# Altium schematic sheet Power.SchDoc
size A4
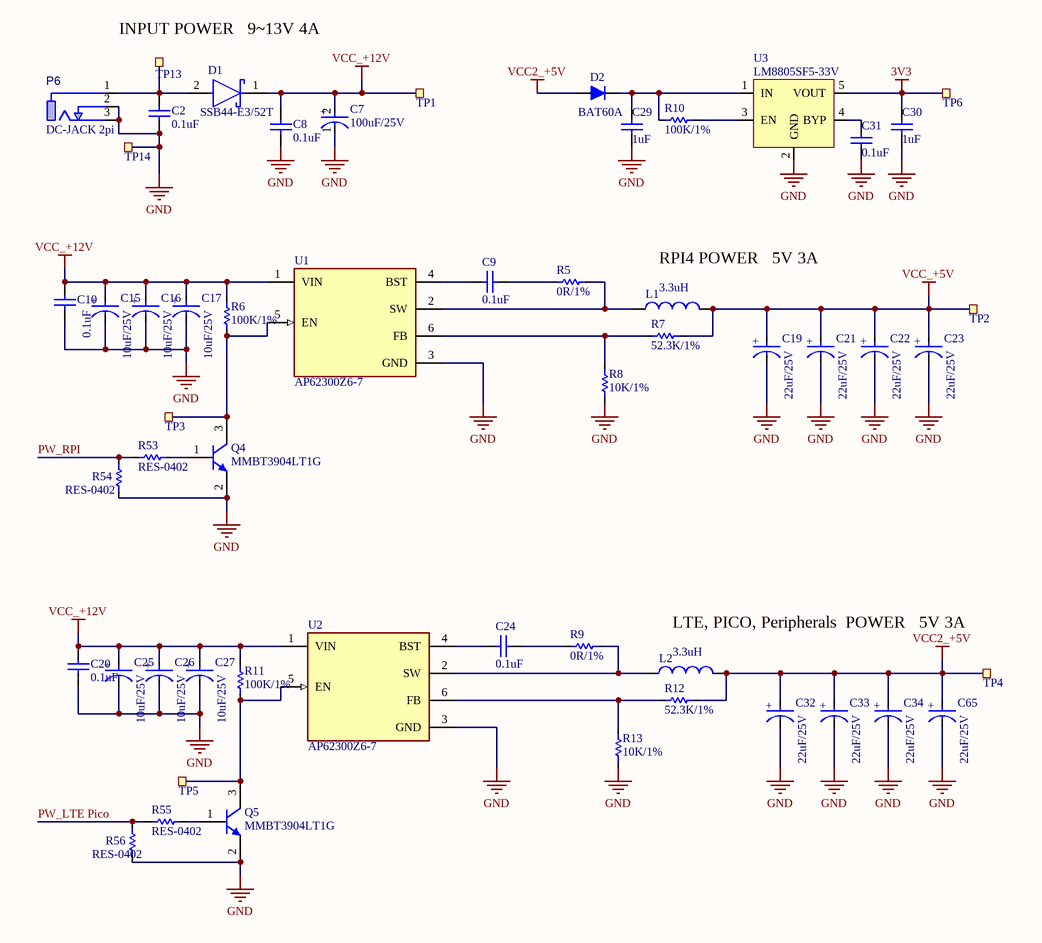
[diagram p0: Power.SchDoc]

## Parts
C2  0.1uF  [CAP-0402]
C7  100uF/25V  [CAP-6.3EC(2+)]
C8  0.1uF  [CAP-0402]
C9  0.1uF  [CAP-0402]
C10  0.1uF  [CAP-0402]
C15  10uF/25V  [CAP-A Size-(2+)]
C16  10uF/25V  [CAP-A Size-(2+)]
C17  10uF/25V  [CAP-A Size-(2+)]
C19  22uF/25V  [CAP-A Size-(2+)]
C20  0.1uF  [CAP-0402]
C21  22uF/25V  [CAP-A Size-(2+)]
C22  22uF/25V  [CAP-A Size-(2+)]
C23  22uF/25V  [CAP-A Size-(2+)]
C24  0.1uF  [CAP-0402]
C25  10uF/25V  [CAP-A Size-(2+)]
C26  10uF/25V  [CAP-A Size-(2+)]
C27  10uF/25V  [CAP-A Size-(2+)]
C29  1uF  [CAP-0402]
C30  1uF  [CAP-0402]
C31  0.1uF  [CAP-0402]
C32  22uF/25V  [CAP-A Size-(2+)]
C33  22uF/25V  [CAP-A Size-(2+)]
C34  22uF/25V  [CAP-A Size-(2+)]
C65  22uF/25V  [CAP-A Size-(2+)]
D1  SSB44-E3/52T  [DO-214AA/SMB(1-C,2-A)]
D2  BAT60A  [SOD-323(1-C,2-A)]
L1  3.3uH  [LPF7030]
L2  3.3uH  [LPF7030]
P6  DC-JACK 2pi  [DC-JACK 2pi]
Q4  MMBT3904LT1G  [ONSC-SOT-23-3-318-08_V]
Q5  MMBT3904LT1G  [ONSC-SOT-23-3-318-08_V]
R5  0R/1%  [RES-0402]
R6  100K/1%  [RES-0402]
R7  52.3K/1%  [RES-0402]
R8  10K/1%  [RES-0402]
R9  0R/1%  [RES-0402]
R10  100K/1%  [RES-0402]
R11  100K/1%  [RES-0402]
R12  52.3K/1%  [RES-0402]
R13  10K/1%  [RES-0402]
R53  RES-0402  [RES-0402]
R54  RES-0402  [RES-0402]
R55  RES-0402  [RES-0402]
R56  RES-0402  [RES-0402]
TP1  TESTPOINT  [TP(SMD)-1PI]  (value not drawn)
TP2  TESTPOINT  [TP(SMD)-1PI]  (value not drawn)
TP3  TESTPOINT  [TP(SMD)-1PI]  (value not drawn)
TP4  TESTPOINT  [TP(SMD)-1PI]  (value not drawn)
TP5  TESTPOINT  [TP(SMD)-1PI]  (value not drawn)
TP6  TESTPOINT  [TP(SMD)-1PI]  (value not drawn)
TP13  TESTPOINT  [TP(SMD)-1PI]  (value not drawn)
TP14  TESTPOINT  [TP(SMD)-1PI]  (value not drawn)
U1  AP62300Z6-7  [SOT-563]
U2  AP62300Z6-7  [SOT-563]
U3  LM8805SF5-33V  [SOT-23-5L]

## Nets
3V3: C30.2 TP6.1(TETSPOINT) U3.5(VOUT)
GND: C2.2 C7.1(C) C8.2 C10.2 C15.1(C) C16.1(C) C17.1(C) C19.1(C) C20.2 C21.1(C) C22.1(C) C23.1(C) C25.1(C) C26.1(C) C27.1(C) C29.1 C30.1 C31.1 C32.1(C) C33.1(C) C34.1(C) C65.1(C) P6.2(GND) P6.3(GND) Q4.2(E) Q5.2(E) R8.2 R13.2 R54.1 R56.1 TP14.1(TETSPOINT) U1.3(GND) U2.3(GND) U3.2(GND)
VCC2_+5V: C32.2(A) C33.2(A) C34.2(A) C65.2(A) D2.2(A) L2.2 R12.1 TP4.1(TETSPOINT)
VCC_+5V: C19.2(A) C21.2(A) C22.2(A) C23.2(A) L1.2 R7.1 TP2.1(TETSPOINT)
VCC_+12V: C7.2(A) C8.1 C10.1 C15.2(A) C16.2(A) C17.2(A) C20.1 C25.2(A) C26.2(A) C27.2(A) D1.1(C) R6.2 R11.2 TP1.1(TETSPOINT) U1.1(VIN) U2.1(VIN)
PW_LTE Pico: R55.2 R56.2
PW_RPI: R53.2 R54.2
NetC2_1: C2.1 D1.2(A) P6.1(VCC) TP13.1(TETSPOINT)
NetC9_1: C9.1 U1.4(BST)
NetC9_2: C9.2 R5.2
NetC24_1: C24.1 U2.4(BST)
NetC24_2: C24.2 R9.2
NetC29_2: C29.2 D2.1(K) R10.1 U3.1(IN)
NetC31_2: C31.2 U3.4(BYP)
NetL1_1: L1.1 R5.1 U1.2(SW)
NetL2_1: L2.1 R9.1 U2.2(SW)
NetQ4_1: Q4.1(B) R53.1
NetQ4_3: Q4.3(C) R6.1 TP3.1(TETSPOINT) U1.5(EN)
NetQ5_1: Q5.1(B) R55.1
NetQ5_3: Q5.3(C) R11.1 TP5.1(TETSPOINT) U2.5(EN)
NetR7_2: R7.2 R8.1 U1.6(FB)
NetR10_2: R10.2 U3.3(EN)
NetR12_2: R12.2 R13.1 U2.6(FB)

## Notes on the sheet
- (near TP13) INPUT POWER   9~13V 4A
- (near L1) RPI4 POWER   5V 3A
- LTE, PICO, Peripherals  POWER   5V 3A
- (in symbol CMP-03017-000014-1) +

## Library data of the parts
C2 C8-C10 C20 C24 C29-C31 = CAP-0402: Ceramic CAP 0402(1005)
C7 = CMP-03017-000014-1: CHIP ALUMINUM ELECTROLYTIC CAPACITORS, 6.3파이; Tolerance: 20%; Life (Hours): 2000Hour; Voltage Rating: 6.3V; ESR (Equivalent Series Resistance): 45mR; Capacitance: 100uF; Case Code (Metric): 3216; Features: General Purpose; Max Operating Temperature: 105°C; Case/Package: 1206; Case Code (Imperial): 1206; Min Operating Temperature: -55°C; Mount: Surface Mount; Packaging: Tape and Reel; RoHS Compliant: Yes
C15-C17 C25-C27 = CMP-03017-000014-1: Chip Tantal A size 10uF 16V; Tolerance: 20%; Life (Hours): 2000Hour; Voltage Rating: 6.3V; ESR (Equivalent Series Resistance): 45mR; Capacitance: 100uF; Case Code (Metric): 3216; Features: General Purpose; Max Operating Temperature: 105°C; Case/Package: 1206; Case Code (Imperial): 1206; Min Operating Temperature: -55°C; Mount: Surface Mount; Packaging: Tape and Reel; RoHS Compliant: Yes
C19 C21-C23 C32-C34 C65 = CMP-03017-000014-1: Chip Tantal A size 22uF 25V; Tolerance: 20%; Life (Hours): 2000Hour; Voltage Rating: 6.3V; ESR (Equivalent Series Resistance): 45mR; Capacitance: 100uF; Case Code (Metric): 3216; Features: General Purpose; Max Operating Temperature: 105°C; Case/Package: 1206; Case Code (Imperial): 1206; Min Operating Temperature: -55°C; Mount: Surface Mount; Packaging: Tape and Reel; RoHS Compliant: Yes
D1 = CMP-1055-00376-2: SMB (DO-214AA); Max Reverse Leakage Current: 2mA; Polarity: Standard; Average Rectified Current: 4A; Max Surge Current: 80A; Output Current: 3A; Element Configuration: Single; Voltage Rating (DC): 20V; Forward Voltage: 500mV; Packaging: Tape and Reel; Package Quantity: 1; Length: 7.11mm; Lead Free: Lead Free; Peak Non-Repetitive Surge Current: 80A; Width: 6.1mm; Max Forward Surge Current (Ifsm): 80A; Height: 2.26mm; Peak Reverse Current: 2mA; Max Operating Temperature: 150°C; Case/Package: SMC; Current Rating: 3A; Max Reverse Voltage (DC): 20V; REACH SVHC: No SVHC; Forward Current: 4A; Radiation Hardening: No; Min Operating Temperature: -65°C; Max Repetitive Reverse Voltage (Vrrm): 20V; Halogen Free: Halogen Free; Number of Pins: 2
D2 = DIODE-BAT60A: Silicon Schottky Diode
L1 L2 = IND-0603: LPF7030T-3R3M
Q4 Q5 = CMP-1048-00631-1: General Purpose Transistor, NPN Silicon, 3-Pin SOT-23, Pb-Free, Tape and Reel; Manufacturer: On Semiconductor; IC Continuous (A): 0.2; fT Min (MHz): 300; ComponentLink2Description: Datasheet; Polarity: NPN; PackageDescription: 3-Pin Small Outline Transistor, Body 2.92 x 1.3 mm, Pitch 0.95 mm; ComponentLink2URL: http://www.onsemi.cn/pub_link/Collateral/MMBT3904LT1-D.PDF; DatasheetVersion: Rev. 12; Mounting Technology: Surface Mount; PartNumber: MMBT3904LT1G; ComponentLink1URL: http://www.onsemi.com/; ComponentLink3Description: Package Specification; ComponentLink1Description: Manufacturer URL; PackageVersion: Rev. AP, 11/2009; PackageReference: SOT-23-3-318-08; Packing: Tape and Reel; ComponentLink3URL: http://www.onsemi.cn/pub_link/Collateral/318-08.PDF; RoHS: TRUE
R5-R13 = RES-0402
R53-R56 = RES-0402: Chip Resistor 0402(1005)
TP1-TP6 TP13 TP14 = TESTPOINT: TEST POINT
U1 U2 = CMP-04918-000669-1: 3A, synchronous buck converter with a wide input voltage range of 4.2V to 18V; RoHS Compliant: Yes
U3 = LM8805SF5-33V: 600mA CMOS LDO Regulator